# EAGLE design 9xVoice (EAGLE 4.16)
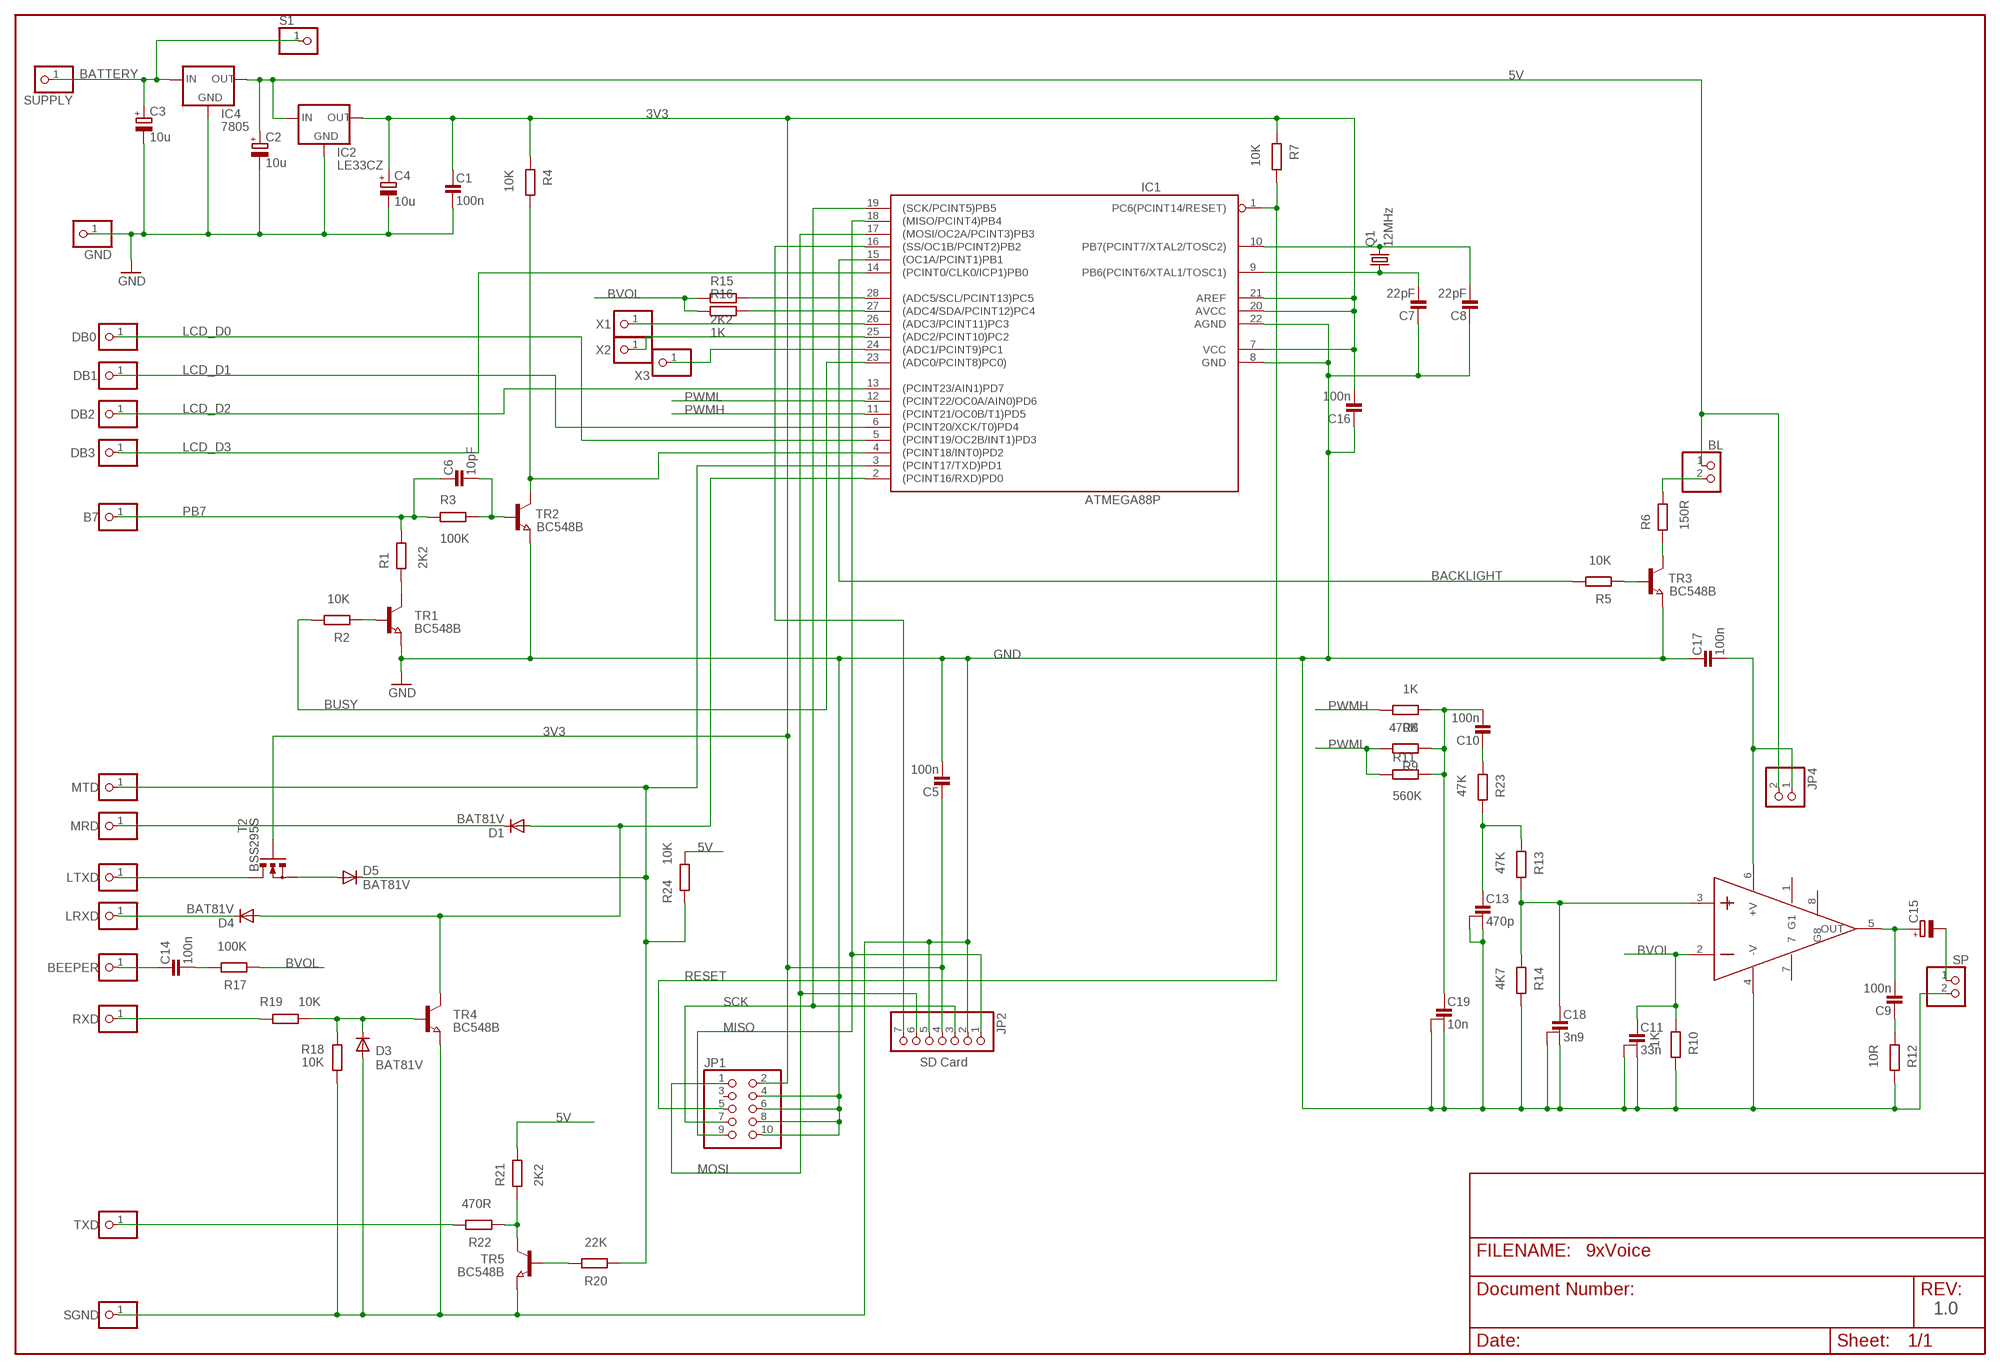
[diagram p0: schematic, sheet 1]

## Parts
B7  PINHD-1X1  [1X01]
BEEPER  PINHD-1X1  [1X01]
BL  PINHD-1X2  [1X02]
C1  100n  CAP2.5X5  [CAP2.5X5]
C2  10u  CPOL-EUE2.5-5  [E2,5-5]
C3  10u  CPOL-EUE2.5-5  [E2,5-5]
C4  10u  CPOL-EUE2.5-5  [E2,5-5]
C5  100n  CAP2.5X5  [CAP2.5X5]
C6  10pF  CAP2.5X5  [CAP2.5X5]
C7  22pF  CAP2.5X5  [CAP2.5X5]
C8  22pF  CAP2.5X5  [CAP2.5X5]
C9  100n  CAP2.5X5  [CAP2.5X5]
C10  100n  CAP2.5X5  [CAP2.5X5]
C11  33n  CAP2  [CAP2.5X5-2]
C13  470p  CAP2  [CAP2.5X5-2]
C14  100n  CAP2.5X5  [CAP2.5X5]
C15  CPOL-EUE5-8.5  [E5-8,5]
C16  100n  CAP2.5X5  [CAP2.5X5]
C17  100n  CAP2.5X5  [CAP2.5X5]
C18  3n9  CAP2  [CAP2.5X5-2]
C19  10n  CAP2  [CAP2.5X5-2]
D1  BAT81V  [D-2.5]
D3  BAT81V  [D-2.5]
D4  BAT81V  [D-2.5]
D5  BAT81V  [D-2.5]
DB0  PINHD-1X1  [1X01]
DB1  PINHD-1X1  [1X01]
DB2  PINHD-1X1  [1X01]
DB3  PINHD-1X1  [1X01]
GND  PINHD-1X1  [1X01]
IC1  ATMEGA88P  [DIL28-3]
IC2  LE33CZ  78LXXVERO  [TO92VERO]
IC3  LM386  [DIL8]
IC4  7805  78XXL  [78XXL]
JP1  PINHD-2X5  [2X05]
JP2  PINHD-1X7  [1X07]
JP4  PINHD-1X2  [1X02]
LRXD  PINHD-1X1  [1X01]
LTXD  PINHD-1X1  [1X01]
MRD  PINHD-1X1  [1X01]
MTD  PINHD-1X1  [1X01]
Q1  12MHz  HC49U-V  [HC49U-V]
R1  2K2  R0207/42MM  [R0207/1]
R2  10K  R0207/47MM  [R0207/3]
R3  100K  R0207/42MM  [R0207/1]
R4  10K  R0207/42MM  [R0207/1]
R5  10K  R0207/42MM  [R0207/1]
R6  150R  R0207/42MM  [R0207/1]
R7  10K  R0207/42MM  [R0207/1]
R8  1K  R0207/42MM  [R0207/1]
R9  470K  R0207/42MM  [R0207/1]
R10  1K  R0207/42MM  [R0207/1]
R11  560K  R0207/42MM  [R0207/1]
R12  10R  R0207/42MM  [R0207/1]
R13  47K  R0207/42MM  [R0207/1]
R14  4K7  R0207/42MM  [R0207/1]
R15  2K2  R0207/42MM  [R0207/1]
R16  1K  R0207/42MM  [R0207/1]
R17  100K  R0207/42MM  [R0207/1]
R18  10K  R0207/42MM  [R0207/1]
R19  10K  R0207/42MM  [R0207/1]
R20  22K  R0207/42MM  [R0207/1]
R21  2K2  R0207/42MM  [R0207/1]
R22  470R  R0207/42MM  [R0207/1]
R23  47K  R0207/42MM  [R0207/1]
R24  10K  R0207/42MM  [R0207/1]
RXD  PINHD-1X1  [1X01]
S1  PINHD-1X1  [1X01]
SGND  PINHD-1X1  [1X01]
SP  PINHD-1X2  [1X02]
SUPPLY  PINHD-1X1  [1X01]
T2  BSS295S  [TO92SIL]
TR1  BC548B  BC109VERO  [TO92SIL]
TR2  BC548B  BC109VERO  [TO92SIL]
TR3  BC548B  BC109VERO  [TO92SIL]
TR4  BC548B  BC109VERO  [TO92SIL]
TR5  BC548B  BC109VERO  [TO92SIL]
TXD  PINHD-1X1  [1X01]
X1  PINHD-1X1  [1X01]
X2  PINHD-1X1  [1X01]
X3  PINHD-1X1  [1X01]

## Nets
3V3: C1.2 C4.+ C5.2 C16.1 IC1.7(VCC) IC1.20(AVCC) IC1.21(AREF) IC2.OUT JP1.2 JP2.4 R4.1 R7.1 T2.2(G)
5V: BL.1 C2.+ IC2.IN IC4.OUT JP4.2 R21.2 R24.2
BACKLIGHT: IC1.15((OC1A/PCINT1)PB1) R5.2
BATTERY: C3.+ IC4.IN S1.1 SUPPLY.1
BUSY: IC1.23((ADC0/PCINT8)PC0)) R2.2
BVOL: C11.2 IC3.2(-) R10.1 R15.1 R16.1 R17.1
GND: C1.1 C2.- C3.- C4.- C5.1 C7.2 C8.2 C11.1 C11.3 C13.1 C13.3 C16.2 C17.2 C18.1 C18.3 C19.1 C19.3 D3.A GND.1 IC1.8(GND) IC1.22(AGND) IC2.GND IC3.4(-V) IC4.GND JP1.4 JP1.6 JP1.8 JP1.10 JP2.2 JP2.5 R10.2 R12.2 R14.2 R18.1 SGND.1 SP.2 TR1.3(E) TR2.3(E) TR3.3(E) TR4.3(E) TR5.3(E)
LCD_D0: DB0.1 IC1.5((PCINT19/OC2B/INT1)PD3)
LCD_D1: DB1.1 IC1.6((PCINT20/XCK/T0)PD4)
LCD_D2: DB2.1 IC1.13((PCINT23/AIN1)PD7)
LCD_D3: DB3.1 IC1.14((PCINT0/CLK0/ICP1)PB0)
MISO: IC1.18((MISO/PCINT4)PB4) JP1.9 JP2.1
MOSI: IC1.17((MOSI/OC2A/PCINT3)PB3) JP1.1 JP2.6
N$1: IC1.4((PCINT18/INT0)PD2) R4.2 TR2.1(C)
N$2: IC1.16((SS/OC1B/PCINT2)PB2) JP2.7
N$3: C6.1 R3.2 TR2.2(B)
N$4: D1.A D4.A IC1.2((PCINT16/RXD)PD0) TR4.1(C)
N$5: R5.1 TR3.2(B)
N$6: R6.1 TR3.1(C)
N$7: BL.2 R6.2
N$11: R1.1 TR1.1(C)
N$12: R2.1 TR1.2(B)
N$14: D1.C MRD.1
N$15: D5.C IC1.3((PCINT17/TXD)PD1) MTD.1 R20.1 R24.1
N$18: IC1.28((ADC5/SCL/PCINT13)PC5) R15.2
N$19: C8.1 IC1.10(PB7(PCINT7/XTAL2/TOSC2)) Q1.2
N$20: C7.1 IC1.9(PB6(PCINT6/XTAL1/TOSC1)) Q1.1
N$21: IC1.27((ADC4/SDA/PCINT12)PC4) R16.2
N$22: BEEPER.1 C14.2
N$23: C18.2 IC3.3(+) R13.2 R14.1
N$24: C13.2 R13.1 R23.2
N$25: C14.1 R17.2
N$26: C9.1 C15.+ IC3.5(OUT)
N$27: C9.2 R12.1
N$28: R21.1 R22.1 TR5.1(C)
N$29: C10.1 C19.2 R8.1 R9.1 R11.2
N$30: D3.C R18.2 R19.2 TR4.2(B)
N$31: R19.1 RXD.1
N$32: R20.2 TR5.2(B)
N$33: C15.- SP.1
N$34: R22.2 TXD.1
N$35: IC1.26((ADC3/PCINT11)PC3) X1.1
N$36: IC1.25((ADC2/PCINT10)PC2) X2.1
N$37: IC1.24((ADC1/PCINT9)PC1) X3.1
N$38: C17.1 IC3.6(+V) JP4.1
N$39: C10.2 R23.1
N$40: D5.A T2.1(S)
N$41: LTXD.1 T2.3(D)
N$42: D4.C LRXD.1
PB7: B7.1 C6.2 R1.2 R3.1
PWMH: IC1.11((PCINT21/OC0B/T1)PD5) R8.2
PWML: IC1.12((PCINT22/OC0A/AIN0)PD6) R9.2 R11.1
RESET: IC1.1(PC6(PCINT14/RESET)) JP1.5 R7.2
SCK: IC1.19((SCK/PCINT5)PB5) JP1.7 JP2.3
Unconnected: IC3.1(G1) IC3.7 IC3.8(G8) JP1.3

## Notes on the sheet
- SD Card
- 1.0

## Library data of the parts
B7 BEEPER DB0 DB1-DB3 GND LRXD LTXD MRD MTD RXD S1 SGND SUPPLY TXD X1-X3 = pinhead:PINHD-1X1: PIN HEADER
BL JP4 SP = pinhead:PINHD-1X2: PIN HEADER
C1 C5-C10 C14 C16 C17 = mikes:CAP
C2-C4 = rcl:CPOL-EU: POLARIZED CAPACITOR, European symbol
C11 C13 C18 C19 = mikes:CAP2
C15 = rcl416:CPOL-EU: POLARIZED CAPACITOR, European symbol
D1 D3-D5 = diode:BAT81: DIODE barrier diode
IC1 = atmel:ATMEGA88
IC2 = v-reg:78LXX: VOLTAGE REGULATOR
IC3 = mikes:LM386
IC4 = v-reg:78XXL: VOLTAGE REGULATOR
JP1 = pinhead:PINHD-2X5: PIN HEADER
JP2 = pinhead:PINHD-1X7: PIN HEADER
Q1 = crystal:HC49U-V: CRYSTAL
R1-R24 = mikes:R0207/4
T2 = transistor-fet:BSS295: FET
TR1-TR5 = mikes:BC109

## Board
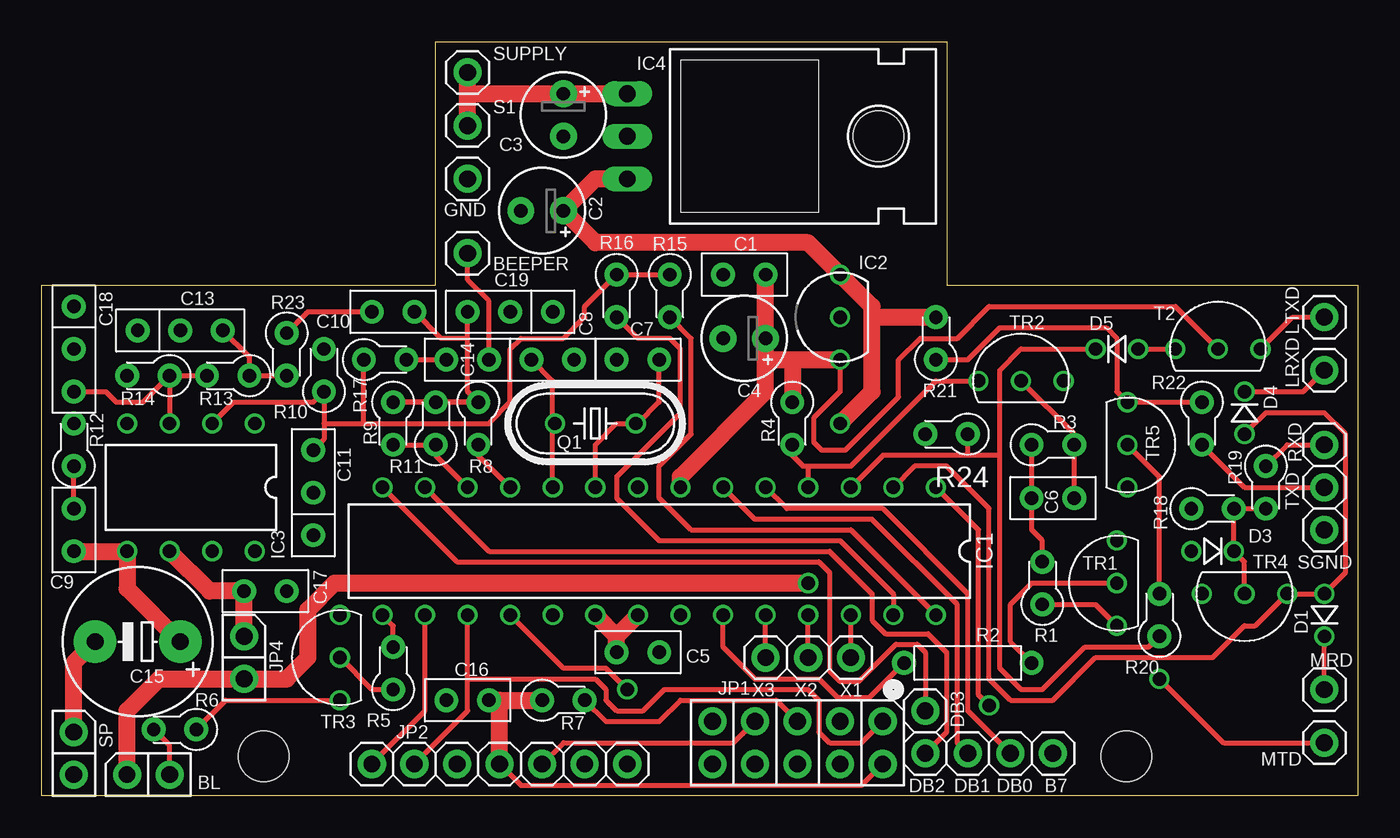
[diagram p1: board, top side]
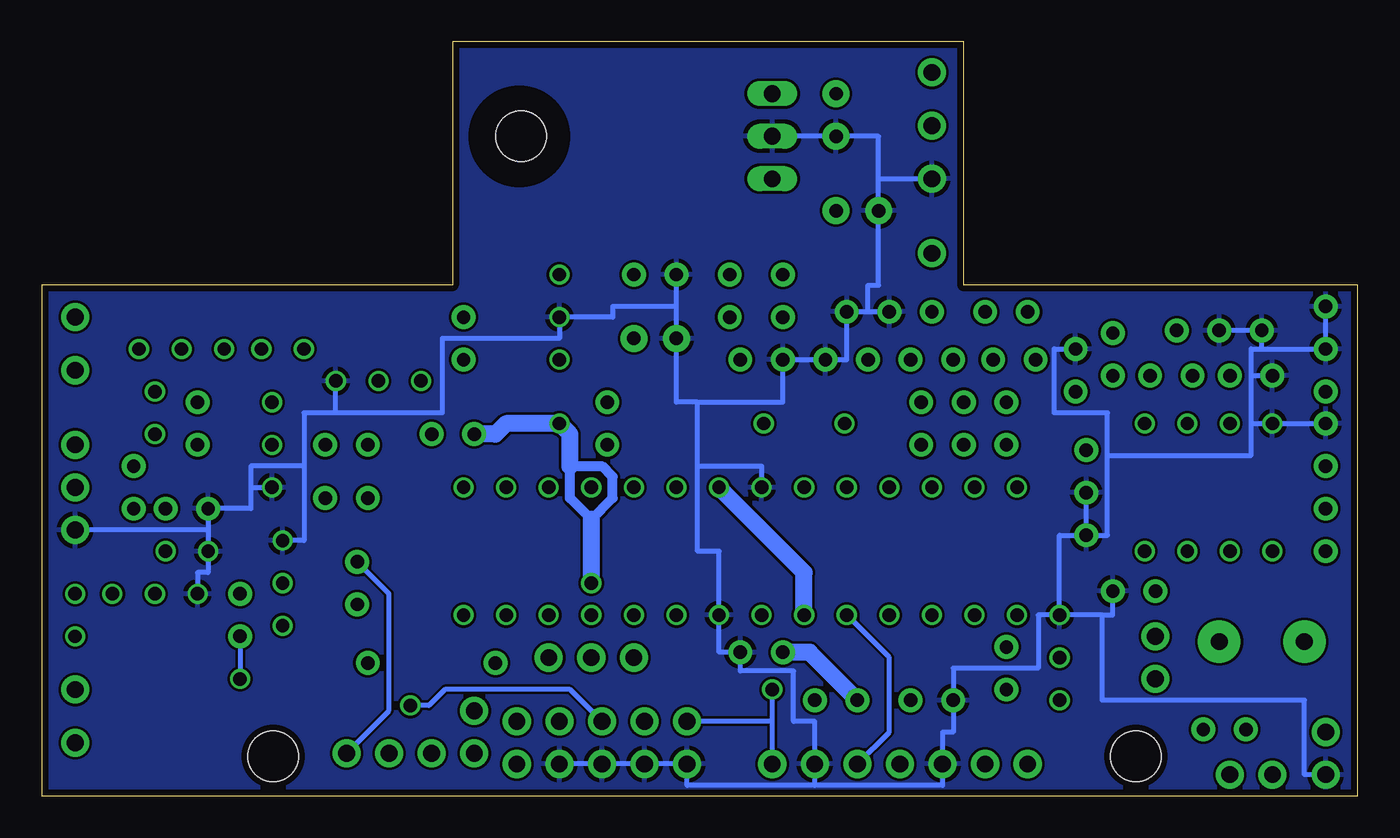
[diagram p2: board, bottom side, seen from below]

Size 78.5 x 45 mm. Coordinates in mm from the lower left corner, seen from the top.
Outline: 0,0 0,30.5 23.5,30.5 23.5,45 54,45 54,30.5 78.5,30.5 78.5,0 0,0
Copper layers (1*16): Top 0.0356mm / dielectric 1.5011mm / Bottom 0.0356mm
Design rules "LaenPCBOrder": minimum track width 6mil, minimum drill 13mil, track to track 6mil, track to pad 6mil, pad to pad 6mil, via to via 6mil, smd to smd 6mil, copper to edge 15mil, drill to drill 6mil, minimum pad ring 7mil, minimum via ring 7mil, stop-mask expansion 4mil, vias tented up to drill 0mil, thermal gap 10mil
Holes 3 mm at 13.23,2.37 64.71,2.37
tKeepout: area 10.7,-0.1 to 15.7,4.9; area 62.2,-0.1 to 67.2,4.9
Milling: 8 lines

### Footprints (pad centres in the part's own frame; a part is rotated, then mirrored left to right if it is on the bottom)
1X01 = drill 1 pad 1.676: 1 0,0
1X02 = drill 1 pad 1.676: 1 -1.27,0; 2 1.27,0
CAP2.5X5 = drill 0.8 pad 1.422: 1 -1.27,0; 2 1.27,0
E2,5-5 = drill 0.8 pad 1.6: + -1.27,0; - 1.27,0
CAP2.5X5-2 = drill 0.8 pad 1.422: 1 -1.27,0; 2 1.27,0; 3 -3.81,0
E5-8,5 = drill 1 pad 2.54: + -2.54,0; - 2.54,0
D-2.5 = drill 0.8: A 1.27,0; C -1.27,0
DIL28-3 = drill 0.8: 1 -16.51,-3.81; 2 -13.97,-3.81; 3 -11.43,-3.81; 4 -8.89,-3.81; 5 -6.35,-3.81; 6 -3.81,-3.81; 7 -1.27,-3.81; 8 1.27,-3.81; 9 3.81,-3.81; 10 6.35,-3.81; 11 8.89,-3.81; 12 11.43,-3.81; 13 13.97,-3.81; 14 16.51,-3.81; 15 16.51,3.81; 16 13.97,3.81; 17 11.43,3.81; 18 8.89,3.81; 19 6.35,3.81; 20 3.81,3.81; 21 1.27,3.81; 22 -1.27,3.81; 23 -3.81,3.81; 24 -6.35,3.81; 25 -8.89,3.81; 26 -11.43,3.81; 27 -13.97,3.81; 28 -16.51,3.81
TO92VERO = drill 0.8: GND 0,0; IN 2.54,0; OUT -2.54,0
DIL8 = drill 0.8: 1 -3.81,-3.81; 2 -1.27,-3.81; 3 1.27,-3.81; 4 3.81,-3.81; 5 3.81,3.81; 6 1.27,3.81; 7 -1.27,3.81; 8 -3.81,3.81
78XXL = drill 1 long: GND 0,-3.81; IN -2.54,-3.81; OUT 2.54,-3.81 | hole 3: 0,11.176
2X05 = drill 1 pad 1.676: 1 -5.08,-1.27; 2 -5.08,1.27; 3 -2.54,-1.27; 4 -2.54,1.27; 5 0,-1.27; 6 0,1.27; 7 2.54,-1.27; 8 2.54,1.27; 9 5.08,-1.27; 10 5.08,1.27
1X07 = drill 1 pad 1.676: 1 -7.62,0; 2 -5.08,0; 3 -2.54,0; 4 0,0; 5 2.54,0; 6 5.08,0; 7 7.62,0
HC49U-V = drill 0.8: 1 -2.413,0; 2 2.413,0
R0207/1 = drill 0.8 pad 1.422: 1 -1.27,0; 2 1.27,0
R0207/3 = drill 0.8 pad 1.422: 1 -3.81,0; 2 3.81,0
TO92SIL = drill 0.8: 1 -2.54,-1.27; 2 0,-1.27; 3 2.54,-1.27

### Placement (x,y rotation side)
B7  60.33,2.54 0 top
BEEPER  25.4,32.38 0 top
BL  6.35,1.27 0 top
C1  41.91,31.12 0 top
C2  29.84,34.92 180 top
C3  31.11,40.64 270 top
C4  41.91,27.3 180 top
C5  35.56,8.57 180 top
C6  60.33,17.78 180 top
C7  35.56,26.04 180 top
C8  30.48,26.04 0 top
C9  1.91,15.88 90 top
C10  20.95,28.89 180 top
C11  16.19,19.37 90 top
C13  9.53,27.78 0 top
C14  25.4,26.04 0 top
C15  5.71,9.21 180 top
C16  25.4,5.71 180 top
C17  13.33,12.22 0 top
C18  1.91,25.4 270 top
C19  26.67,28.89 180 top
D1  76.52,10.79 90 top
D3  69.85,14.61 180 top
D4  71.75,22.86 270 top
D5  64.14,26.67 0 top
DB0  57.78,2.54 180 top
DB1  55.24,2.54 180 top
DB2  52.7,2.54 180 top
DB3  52.7,5.08 180 top
GND  25.4,36.83 0 top
IC1  36.83,14.61 180 top
IC2  47.62,28.57 90 top
IC3  8.89,18.41 180 top
IC4  38.73,39.37 270 top
JP1  45.09,3.17 180 top
JP2  27.3,1.91 180 top
JP4  12.06,8.26 270 top
LRXD  76.52,25.4 0 top
LTXD  76.52,28.57 0 top
MRD  76.52,6.35 180 top
MTD  76.52,3.17 180 top
Q1  33.02,22.23 180 top
R1  59.69,12.7 90 top
R2  55.24,7.94 180 top
R3  60.33,20.95 0 top
R4  44.77,22.23 270 top
R5  20.95,7.62 90 top
R6  7.94,3.97 180 top
R7  31.11,5.71 0 top
R8  26.04,22.23 270 top
R9  20.95,22.23 270 top
R10  16.83,25.4 90 top
R11  23.5,22.23 90 top
R12  1.91,20.95 90 top
R13  11.11,25.08 180 top
R14  6.35,25.08 180 top
R15  37.47,29.84 270 top
R16  34.29,29.84 270 top
R17  20.48,26.04 0 top
R18  69.85,17.14 0 top
R19  73.03,18.41 270 top
R20  66.67,10.79 90 top
R21  53.34,27.3 90 top
R22  69.22,22.22 270 top
R23  14.61,26.35 270 top
R24  53.98,21.59 180 top
RXD  76.52,20.95 180 top
S1  25.4,40.01 0 top
SGND  76.52,15.88 180 top
SP  1.91,2.54 270 top
SUPPLY  25.4,43.18 0 top
T2  70.17,27.94 0 top
TR1  62.87,12.7 90 top
TR2  58.42,26.04 0 top
TR3  16.51,8.26 90 top
TR4  71.75,10.79 180 top
TR5  66.04,20.95 270 top
TXD  76.52,18.41 180 top
X1  48.26,8.26 0 top
X2  45.72,8.26 0 top
X3  43.18,8.26 0 top

### Tracks (layer width: path | path; a pad name or v marks a point on that pad's centre or on a via)
3V3
  Top 0.305: JP2.4 28.57,0.64 48.9,0.64 JP1.2 | T2.2 67.63,29.21 56.52,29.21 54.61,27.3 52.39,27.3 51.12,26.04 51.12,23.81 47.94,20.64 46.51,20.64 46.04,21.11 46.04,22.54 47.62,24.13 IC2.OUT | 27.3,5.71
  Top 1.016: C5.2 34.29,9.53 | 34.29,9.53 IC1.20 | 34.29,9.53 IC1.21 | IC1.7 38.1,19.05 43.18,24.13 43.18,26.04 | 43.18,26.04 C4.+ C1.2 | JP2.4 27.3,5.71 | 27.3,5.71 C16.1 | 44.77,26.04 IC2.OUT | 44.77,26.04 R4.1 | 43.18,26.04 44.77,26.04 | 27.3,5.71 R7.1
  Bottom 1.016: IC1.7 33.02,13.34 IC1.20 | C5.2 32.7,8.57 R7.1
5V  (via drill 0.8, 0.8 pad 0.25)
  Top 1.016: IC4.OUT 33.02,36.83 C2.+ 33.02,33.02 45.72,33.02 IC2.IN 49.53,29.21 49.53,28.57 | v47.62,22.23 49.53,24.13 49.53,28.57 | 49.53,28.57 R21.2 | BL.1 | BL.1 5.08,5.08 6.99,6.99 JP4.2 14.61,6.99 15.88,8.26 15.88,11.11 17.46,12.7 v45.72,12.7
  Bottom 0.61: 46.99,19.68 45.09,19.68 44.45,19.05 44.45,17.78 45.72,16.51 46.99,17.78 46.99,19.68
  Bottom 1.016: v45.72,12.7 45.72,16.51 | 46.99,19.68 46.99,21.59 v47.62,22.23 50.8,22.23 51.44,21.59 R24.2
BACKLIGHT
  Top 0.305: R5.2 20.95,10.16 IC1.15
BATTERY
  Top 1.016: IC4.IN C3.+ 25.4,41.91 | 25.4,41.91 SUPPLY.1 | S1.1 25.4,41.91
BUSY
  Top 0.305: R2.2 49.37,5.87 47.47,5.87 46.35,6.99 42.55,6.99 40.64,8.89 IC1.23
BVOL
  Top 0.305: IC3.2 11.43,23.5 16.19,23.5 R10.1 16.83,22.23 | R15.1 R16.1 32.38,29.21 32.38,28.57 31.11,27.3 28.57,27.3 27.94,26.67 27.94,23.5 26.67,22.23 19.21,22.23 | 19.21,22.23 R17.1 | 16.83,22.23 19.21,22.23 | 16.83,22.23 16.83,21.27 C11.2
GND
  Bottom 0.305: 32.38,0.64 40.01,0.64 JP1.10 JP1.8 JP1.6 JP1.4 | 32.38,0.64 JP2.2 32.38,4.45 33.66,4.45 33.66,7.46 36.83,7.46 C5.1 38.1,8.57 IC1.22 38.1,14.61 39.37,14.61 39.37,19.68 | 39.37,19.68 35.56,19.68 IC1.8 | 39.37,19.68 39.37,23.5 | 39.37,23.5 34.29,23.5 C7.2 C8.2 30.48,26.04 C19.3 29.21,28.89 | 32.38,0.64 24.77,0.64 JP2.5 24.77,3.81 24.13,3.81 C16.2 24.13,7.62 19.05,7.62 19.05,10.79 TR3.3 | R12.2 IC3.4 6.35,22.23 | 14.92,20.32 14.92,15.56 C11.3 | SP.2 3.17,1.27 3.17,5.71 15.24,5.71 15.24,10.79 | C11.3 17.78,15.56 TR3.3 | 39.37,23.5 40.64,23.5 C4.- 40.64,29.21 | IC4.GND C3.- 28.57,39.37 28.57,36.83 | 28.57,36.83 C2.- 28.57,30.48 29.21,30.48 29.21,28.89 | 28.57,36.83 GND.1 | 60.96,22.86 54.61,22.86 54.61,27.3 47.62,27.3 IC2.GND 44.45,28.57 44.45,29.21 40.64,29.21 | 60.96,22.86 62.87,22.86 62.87,19.68 | 14.92,20.32 6.35,20.32 6.35,22.23 | 6.35,22.23 6.35,25.08 | 6.35,25.08 6.35,26.67 5.71,26.67 | 14.92,20.32 14.92,22.86 18.1,22.86 18.1,26.67 R10.2 | 29.21,28.89 C19.1 | C18.3 C18.1 5.71,26.67 | C11.3 C11.1 | 66.04,18.41 66.04,17.14 R18.1 68.58,15.88 | 62.87,19.68 62.87,15.24 TR1.3 | 66.04,18.41 TR5.3 | 62.87,19.68 66.04,19.68 66.04,18.41 | 15.24,10.79 TR3.3 | 15.24,10.79 14.61,10.79 C17.2 | 40.64,29.21 C1.1 | 68.58,15.88 | D3.A | 68.58,15.88 D3.A | D3.A | D3.A 68.58,13.34 69.22,13.34 TR4.3 | 6.35,25.08 R14.2 | 5.71,26.67 C13.3 C13.1 | 68.58,15.88 SGND.1 | 60.96,22.86 TR2.3 | C17.2
  pour Bottom: 0,0 0,30.48 23.5,30.48 23.5,45.09 53.98,45.09 53.98,30.48 78.42,30.48 78.42,0
LCD_D0
  Top 0.305: IC1.5 44.45,17.14 50.16,17.14 55.24,12.06 55.24,5.08 DB0.1
LCD_D1
  Top 0.305: IC1.6 42.55,16.51 49.53,16.51 54.61,11.43 54.61,3.17 DB1.1
LCD_D2
  Top 0.305: IC1.13 26.67,14.61 46.99,14.61 49.53,12.06 49.53,10.48 50.32,9.68 52.86,9.68 | 52.86,9.68 53.98,8.57 53.98,3.81 DB2.1 | 52.86,9.68
LCD_D3
  Top 0.305: IC1.14 24.77,13.97 46.35,13.97 46.99,13.34 46.99,7.46 47.62,6.83 48.74,6.83 50.96,9.05 52.23,9.05 | 52.23,9.05 | 52.23,9.05 52.7,8.57 DB3.1 | DB3.1
MISO  (via drill 0.8)
  Top 0.305: IC1.18 31.11,7.62 33.66,7.62 v34.92,6.35
  Bottom 0.305: JP2.1 34.92,4.45 | 34.92,4.45 v34.92,6.35 | 34.92,4.45 JP1.9
MOSI
  Top 0.305: JP2.6 25.4,5.08 25.4,6.99 | 25.4,6.99 33.02,6.99 33.66,6.35 33.66,5.71 34.29,5.08 35.88,5.08 37.15,6.35 45.72,6.35 46.35,5.71 46.35,3.81 46.99,3.17 48.9,3.17 JP1.1 | 25.4,6.99 IC1.17
N$1
  Top 0.305: 45.72,19.68 45.4,19.68 44.77,20.32 R4.2 | 45.72,19.68 IC1.4 | 45.72,19.68 48.26,19.68 53.34,24.77 TR2.1
N$2
  Top 0.305: JP2.7 22.86,5.08 IC1.16
N$3
  Top 0.305: TR2.2 61.59,21.59 R3.2 C6.1
N$4
  Top 0.305: IC1.2 52.07,19.68 53.98,19.68 56.52,17.14 56.52,6.99 57.78,5.71 60.33,5.71 62.87,8.26 69.85,8.26 71.75,10.16 72.39,10.16 TR4.1 D1.A | D4.A 73.03,22.86 76.52,22.86 77.79,21.59 77.79,13.34 D1.A | D1.A | D1.A
N$5
  Top 0.305: R5.1 19.68,6.35 TR3.2
N$6
  Top 0.305: TR3.1 10.95,5.71 R6.1
N$7
  Top 0.305: BL.2 | R6.2 7.62,3.02 BL.2
N$11
  Top 0.305: R1.1 62.87,11.43 TR1.1
N$12
  Top 0.305: R2.1 57.78,9.21 57.78,11.43 59.05,12.7 TR1.2
N$14
  Top 0.305: MRD.1 | MRD.1 D1.C
N$15  (via drill 0.8)
  Top 0.305: IC1.3 50.16,20.32 55.24,20.32 | 57.15,20.32 55.24,20.32 | R20.1 66.04,8.89 62.23,8.89 59.69,6.35 58.42,6.35 57.15,7.62 57.15,20.32 | D5.C 58.42,26.67 57.15,25.4 57.15,20.32 | 55.24,20.32 R24.1 | v66.67,6.99 70.48,3.17 MTD.1 | MTD.1
  Bottom 0.305: R20.1 v66.67,6.99
N$18
  Top 0.305: R15.2 38.73,27.3 38.73,21.59 36.83,19.68 36.83,17.78 38.73,15.88 48.26,15.88 IC1.28
N$19
  Top 0.305: IC1.10 30.48,22.1 Q1.2 30.48,22.23 30.48,24.77 C8.1
N$20
  Top 0.305: IC1.9 33.02,20.95 34.29,22.23 Q1.1 35.56,22.23 36.83,23.5 C7.1
N$21
  Top 0.305: IC1.27 50.8,12.06 47.62,15.24 36.83,15.24 34.29,17.78 34.29,19.05 38.1,22.86 38.1,26.67 37.47,27.3 35.56,27.3 R16.2
N$22
  Top 0.305: C14.2 26.67,29.53 25.4,30.8 BEEPER.1
N$23
  Top 0.305: R14.1 6.03,23.5 4.45,23.5 3.81,24.13 C18.2 | R14.1 IC3.3 | R13.2 R14.1
N$24
  Top 0.305: C13.2 12.38,26.19 R13.1 | R13.1 | R13.1 R23.2
N$25
  Top 0.305: R17.2 C14.1
N$26
  Top 1.016: C15.+ 5.08,12.38 IC3.5 C9.1
N$27
  Top 0.305: C9.2 R12.1
N$28
  Top 0.305: R21.1 55.24,26.04 57.15,27.94 63.5,27.94 64.14,27.3 64.14,24.13 TR5.1 R22.1 | R22.1
N$29
  Top 0.305: 21.59,23.5 R11.2 R8.1 | R9.1 R8.1 | C10.1 23.81,27.3 25.4,27.3 | R8.1 25.4,24.13 25.4,27.3 | 25.4,27.3 C19.2
N$30
  Top 0.305: TR4.2 71.75,13.97 D3.C | D3.C R18.2 R19.2 | D3.C
N$31
  Top 0.305: RXD.1 74.3,20.95 R19.1
N$32
  Top 0.305: TR5.2 66.67,19.05 R20.2
N$33
  Top 1.016: SP.1 1.91,7.94 C15.-
N$34
  Top 0.305: R22.2 71.75,18.41 TXD.1
N$35
  Top 0.305: X1.1 IC1.26
N$36
  Top 0.305: X2.1 IC1.25
N$37
  Top 0.305: X3.1 IC1.24
N$38
  Top 1.016: IC3.6 10,12.22 C17.1 12.06,12.06 | 12.06,12.06 | JP4.1 12.06,12.06
N$39
  Top 0.305: R23.1 15.88,28.89 C10.2
N$40
  Top 0.305: D5.A T2.1
N$41
  Top 0.305: LTXD.1 74.61,28.57 T2.3
N$42
  Top 0.305: LRXD.1 75.25,24.13 D4.C
PB7
  Top 0.305: R3.1 C6.2 59.05,15.88 59.69,15.24 R1.2
  Bottom 0.305: B7.1 57.78,5.08 57.78,12.06 R1.2
PWMH
  Top 0.305: IC1.11 26.04,20.32 R8.2
PWML
  Top 0.305: IC1.12 23.5,20.32 R11.1 R9.2
RESET  (via drill 0.8)
  Top 0.305: R7.2 33.66,4.45 36.83,4.45 38.1,5.71 43.81,5.71 JP1.5 | IC1.1 55.88,15.88 55.88,6.03 v56.52,5.4
  Bottom 0.305: v56.52,5.4 55.4,5.4 54.45,6.35 46.99,6.35 JP1.5
SCK
  Top 0.305: JP2.3 31.11,3.17 41.27,3.17 JP1.7
  Bottom 0.305: JP2.3 27.94,3.81 27.94,8.26 IC1.19